# Altium schematic sheet PowerModule.SchDoc
size A3; SheetNumber: 4; SheetTotal: 10
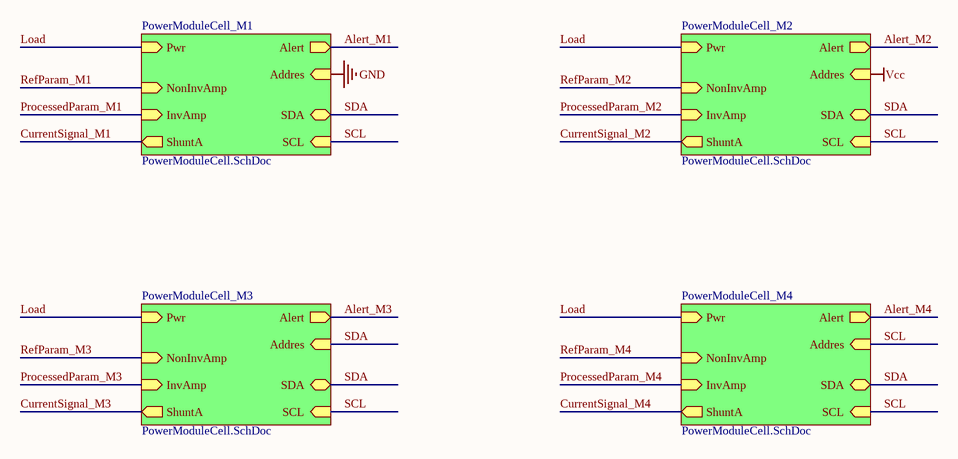
[diagram p0: PowerModule.SchDoc]

## Sub-sheets
PowerModuleCell_M1 = PowerModuleCell.SchDoc: Alert (out), Addres (in), SDA (bidir), SCL (in), Pwr (in), NonInvAmp (in), InvAmp (in), ShuntA (out)
PowerModuleCell_M2 = PowerModuleCell.SchDoc: Alert (out), Addres (in), SDA (bidir), SCL (in), Pwr (in), NonInvAmp (in), InvAmp (in), ShuntA (out)
PowerModuleCell_M3 = PowerModuleCell.SchDoc: Alert (out), Addres (in), SDA (bidir), SCL (in), Pwr (in), NonInvAmp (in), InvAmp (in), ShuntA (out)
PowerModuleCell_M4 = PowerModuleCell.SchDoc: Alert (out), Addres (in), SDA (bidir), SCL (in), Pwr (in), NonInvAmp (in), InvAmp (in), ShuntA (out)

## Nets
GND: sheet PowerModuleCell_M1/Addres
Vcc: sheet PowerModuleCell_M2/Addres
Alert_M1: sheet PowerModuleCell_M1/Alert
Alert_M2: sheet PowerModuleCell_M2/Alert
Alert_M3: sheet PowerModuleCell_M3/Alert
Alert_M4: sheet PowerModuleCell_M4/Alert
CurrentSignal_M1: sheet PowerModuleCell_M1/ShuntA
CurrentSignal_M2: sheet PowerModuleCell_M2/ShuntA
CurrentSignal_M3: sheet PowerModuleCell_M3/ShuntA
CurrentSignal_M4: sheet PowerModuleCell_M4/ShuntA
Load: sheet PowerModuleCell_M1/Pwr, sheet PowerModuleCell_M3/Pwr, sheet PowerModuleCell_M2/Pwr, sheet PowerModuleCell_M4/Pwr
ProcessedParam_M1: sheet PowerModuleCell_M1/InvAmp
ProcessedParam_M2: sheet PowerModuleCell_M2/InvAmp
ProcessedParam_M3: sheet PowerModuleCell_M3/InvAmp
ProcessedParam_M4: sheet PowerModuleCell_M4/InvAmp
RefParam_M1: sheet PowerModuleCell_M1/NonInvAmp
RefParam_M2: sheet PowerModuleCell_M2/NonInvAmp
RefParam_M3: sheet PowerModuleCell_M3/NonInvAmp
RefParam_M4: sheet PowerModuleCell_M4/NonInvAmp
SCL: sheet PowerModuleCell_M1/SCL, sheet PowerModuleCell_M3/SCL, sheet PowerModuleCell_M2/SCL, sheet PowerModuleCell_M4/Addres, sheet PowerModuleCell_M4/SCL
SDA: sheet PowerModuleCell_M1/SDA, sheet PowerModuleCell_M3/Addres, sheet PowerModuleCell_M3/SDA, sheet PowerModuleCell_M2/SDA, sheet PowerModuleCell_M4/SDA